# Altium schematic sheet Microcontroller.SchDoc
size A; SheetNumber: 2; SheetTotal: 2
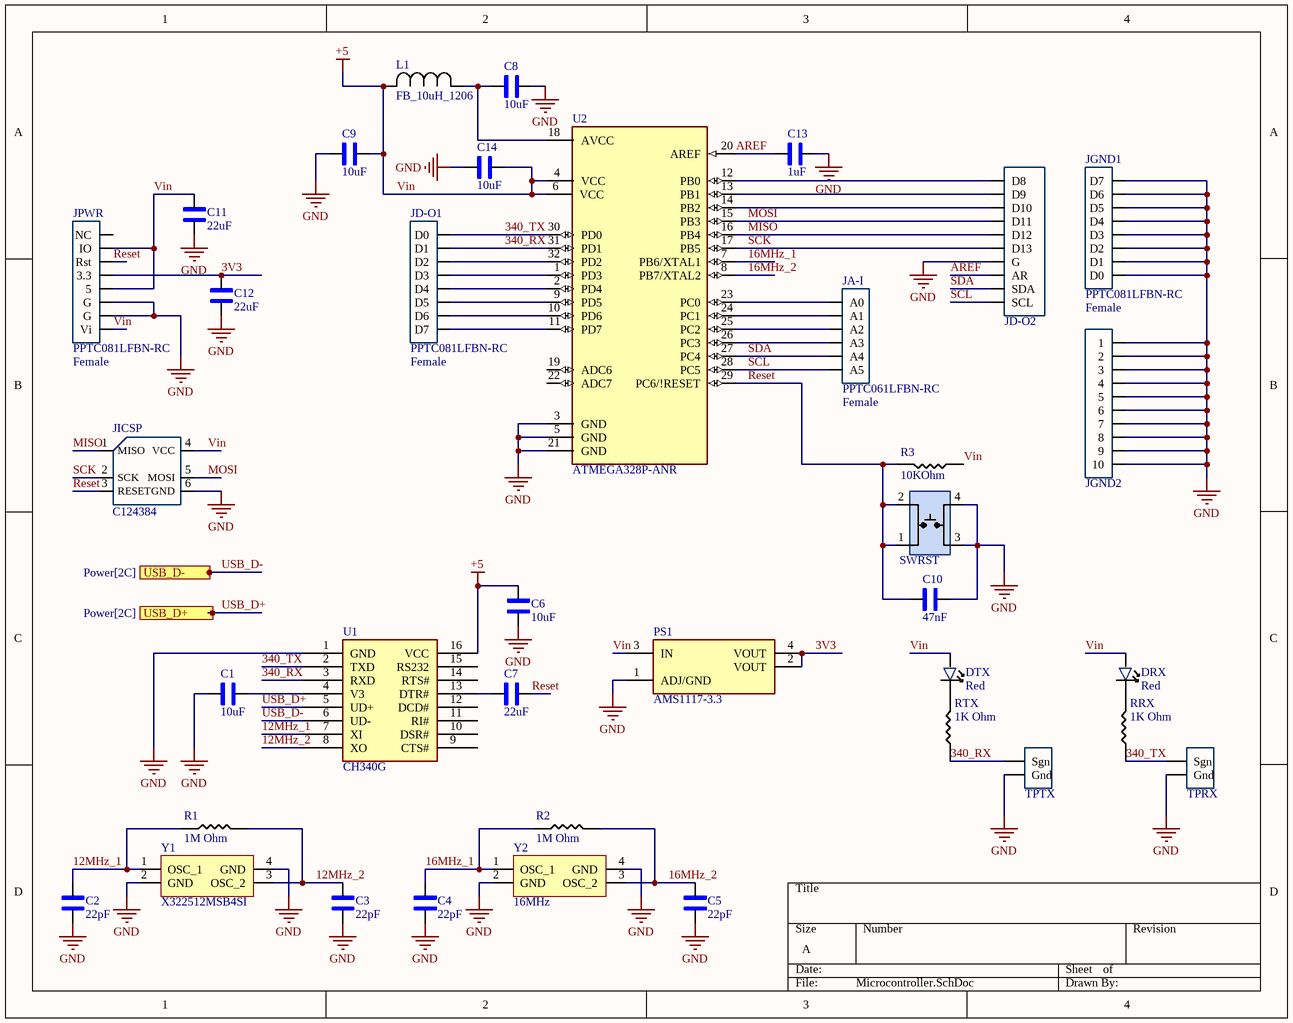
[diagram p0: Microcontroller.SchDoc]

## Parts
C1  10uF  [1206_Passive_Capacitor]
C2  22pF  [1206_Passive_Capacitor]
C3  22pF  [1206_Passive_Capacitor]
C4  22pF  [1206_Passive_Capacitor]
C5  22pF  [1206_Passive_Capacitor]
C6  10uF  [1206_Passive_Capacitor]
C7  22uF  [1206_Passive_Capacitor]
C8  10uF  [1206_Passive_Capacitor]
C9  10uF  [1206_Passive_Capacitor]
C10  47nF  [1206_Passive_Capacitor]
C11  22uF  [1206_Passive_Capacitor]
C12  22uF  [1206_Passive_Capacitor]
C13  1uF  [1206_Passive_Capacitor]
C14  10uF  [1206_Passive_Capacitor]
DRX  Red  [LED_1206]
DTX  Red  [LED_1206]
JA-I  PPTC061LFBN-RC  value Female  [6_PIN_ARD-Analog_100mil]
JD-O1  PPTC081LFBN-RC  value Female  [8_PIN_ARD-DIG_100MIL]
JD-O2  PPTC101LFBN-RC  [10_PIN_ARDUINO_100MIL]  (value not drawn)
JGND1  PPTC081LFBN-RC  value Female  [8_PIN_ARD-DIG_100MIL]
JGND2  PPTC101LFBN-RC  [10_PIN_100MIL - Female]  (value not drawn)
JICSP  LCSC Part#: C124384  [ICSP]  (hidden comment: NRPN032PAEN-RC)
JPWR  PPTC081LFBN-RC  value Female  [8_PIN_ARD-PWR_100MIL]
L1  FB_10uH_1206  [AIML-1206_ABR-M]
PS1  AMS1117-3.3  [LDO]
R1  value 1M Ohm  [1206_Passive_Resitor]  (hidden comment: 1M)
R2  value 1M Ohm  [1206_Passive_Resitor]  (hidden comment: 1M)
R3  value 10KOhm  [1206_Passive_Resitor]  (hidden comment: 10k)
RRX  value 1K Ohm  [1206_Passive_Resitor]  (hidden comment: 1k)
RTX  value 1K Ohm  [1206_Passive_Resitor]  (hidden comment: 1k)
SWRST  TL3305AF160QG  [Switch_JLC]  (value not drawn)
TPRX  10x Probe TP  [TP10x_Probe]  (value not drawn)
TPTX  10x Probe TP  [TP10x_Probe]  (value not drawn)
U1  CH340G  [USB to serial]
U2  ATMEGA328P-ANR  [ATMega328P]
Y1  X322512MSB4SI  [Crystal resonator]
Y2  value 16MHz  [Crystal resonator]  (hidden comment: X322516MLB4SI)

## Ports
USB_D+ (in, see Power[2C]), USB_D- (in, see Power[2C])

## Nets
GND: C1.1 C2.1 C3.1 C4.1 C5.1 C6.1 C8.1 C9.2 C10.1 C11.1 C12.1 C13.2 C14.2 JD-O2.4(G) JGND1.1(D7) JGND1.2(D6) JGND1.3(D5) JGND1.4(D4) JGND1.5(D3) JGND1.6(D2) JGND1.7(D1) JGND1.8(D0) JGND2.1 JGND2.2 JGND2.3 JGND2.4 JGND2.5 JGND2.6 JGND2.7 JGND2.8 JGND2.9 JGND2.10 JICSP.6(GND) JPWR.6(G) JPWR.7(G) PS1.1(ADJ/GND) SWRST.3 SWRST.4 TPRX.2(Gnd) TPTX.2(Gnd) U1.1(GND) U2.3(GND) U2.5(GND) U2.21(GND) Y1.2(GND) Y1.4(GND) Y2.2(GND) Y2.4(GND)
Vin: C6.2 C9.1 C11.2 C14.1 DRX.1 DTX.1 JICSP.4(VCC) JPWR.2(IO) JPWR.5 JPWR.8(Vi) L1.2 PS1.3(IN) R3.1 U1.16(VCC) U2.4(VCC) U2.6(VCC)  [also labelled +5]
3V3: C12.2 JPWR.4(3.3) PS1.2(VOUT) PS1.4(VOUT)
12MHz_1: C2.2 R1.1 U1.7(XI) Y1.1(OSC_1)
12MHz_2: C3.2 R1.2 U1.8(XO) Y1.3(OSC_2)
16MHz_1: C4.2 R2.1 U2.7(PB6/XTAL1) Y2.1(OSC_1)
16MHz_2: C5.2 R2.2 U2.8(PB7/XTAL2) Y2.3(OSC_2)
340_RX: JD-O1.7(D1) RTX.1 TPTX.1(Sgn) U1.3(RXD) U2.31(PD1)
340_TX: JD-O1.8(D0) RRX.1 TPRX.1(Sgn) U1.2(TXD) U2.30(PD0)
AREF: C13.1 JD-O2.3(AR) U2.20(AREF)
MISO: JD-O2.6(D12) JICSP.1(MISO) U2.16(PB4)
MOSI: JD-O2.7(D11) JICSP.5(MOSI) U2.15(PB3)
Reset: C7.2 C10.2 JICSP.3(RESET) JPWR.3(Rst) R3.2 SWRST.1 SWRST.2 U2.29(PC6/!RESET)
SCK: JD-O2.5(D13) JICSP.2(SCK) U2.17(PB5)
SCL: JA-I.6(A5) JD-O2.1(SCL) U2.28(PC5)
SDA: JA-I.5(A4) JD-O2.2(SDA) U2.27(PC4)
USB_D+: U1.5(UD+) ; port USB_D+
USB_D-: U1.6(UD-) ; port USB_D-
NetC1_2: C1.2 U1.4(V3)
NetC7_1: C7.1 U1.13(DTR#)
NetC8_2: C8.2 L1.1 U2.18(AVCC)
NetDRX_2: DRX.2 RRX.2
NetDTX_2: DTX.2 RTX.2
NetJA-I_1: JA-I.1(A0) U2.23(PC0)
NetJA-I_2: JA-I.2(A1) U2.24(PC1)
NetJA-I_3: JA-I.3(A2) U2.25(PC2)
NetJA-I_4: JA-I.4(A3) U2.26(PC3)
NetJD-O1_1: JD-O1.1(D7) U2.11(PD7)
NetJD-O1_2: JD-O1.2(D6) U2.10(PD6)
NetJD-O1_3: JD-O1.3(D5) U2.9(PD5)
NetJD-O1_4: JD-O1.4(D4) U2.2(PD4)
NetJD-O1_5: JD-O1.5(D3) U2.1(PD3)
NetJD-O1_6: JD-O1.6(D2) U2.32(PD2)
NetJD-O2_8: JD-O2.8(D10) U2.14(PB2)
NetJD-O2_9: JD-O2.9(D9) U2.13(PB1)
NetJD-O2_10: JD-O2.10(D8) U2.12(PB0)

Not connected (* = marked no-connect by the designer): JPWR 1(NC); U1 9(CTS#) 10(DSR#) 11(RI#) 12(DCD#) 14(RTS#) 15(RS232); U2 19(ADC6) 22(ADC7)

## Library data of the parts
C1 C6 C8 C9 C14 = C_10uF_1206: 10uF ±10% 50V X5R 1206 Multilayer Ceramic Capacitors MLCC - SMD/SMT RoHS; MFR Part #: CL31A106KBHNNNE; Type: Basic; LCSC Part#: C13585; Datasheet: https://datasheet.lcsc.com/lcsc/1810221112_Samsung-Electro-Mechanics-CL31A106KBHNNNE_C13585.pdf; Value: 10uF
C2-C5 = C_22pF_1206: 22pF ±5% 1kV C0G 1206 Multilayer Ceramic Capacitors MLCC - SMD/SMT RoHS; MFR Part #: CC1206JKNPOCBN220; Type: Extended; LCSC Part#: C107174; Datasheet: https://datasheet.lcsc.com/lcsc/1810241219_YAGEO-CC1206JKNPOCBN220_C107174.pdf; Value: 22pF
C7 C11 C12 = C_22uF_1206: 22uF ±10% 25V X5R 1206 Multilayer Ceramic Capacitors MLCC - SMD/SMT RoHS; MFR Part #: CL31A226KAHNNNE; Type: basic; LCSC Part#: C12891; Datasheet: https://datasheet.lcsc.com/lcsc/1811031514_Samsung-Electro-Mechanics-CL31A226KAHNNNE_C12891.pdf; Value: 22uF
C10 = C_47nF_1206: 47nF ±5% 50V C0G 1206 Multilayer Ceramic Capacitors MLCC - SMD/SMT RoHS; MFR Part #: GRM31M5C1H473JA01L; Type: Extended; LCSC Part#: C21812; Datasheet: https://datasheet.lcsc.com/lcsc/1810201313_Murata-Electronics-GRM31M5C1H473JA01L_C21812.pdf; Value: 47nF
C13 = C_1uF_1206: MULTILAYER CERAMIC CAPACITORS MLCC - SMD/SMT 1UF 50V 1206 ROHS; MFR Part #: CL31B105KBHNNNE; Type: Basic; Digikey Link: https://www.digikey.com/product-detail/en/C1206C105M4RACTU/399-8150-1-ND/3471873/?itemSeq=304982366; LCSC Part#: C1848; Value: 1uF
DRX DTX = LED_RED_1206: Red 621~631nm 1206 Light Emitting Diodes (LED) RoHS; MFR Part #: 15-21/R6C-FQ1R1B/2T; LCSC Part#: C93133; Type: Extended; Datasheet: https://datasheet.lcsc.com/szlcsc/1811151241_Everlight-Elec-15-21-R6C-FQ1R1B-2T_C93133.pdf; Value: Red
JA-I = JF_6_PIN_FEMA_ARD-Anolog: 6 Position Header Connector 0.100" (2.54mm) Through Hole Tin; Digikey Link: https://www.digikey.com/product-detail/en/PPTC061LFBN-RC/S7004-ND/810145/?itemSeq=304982353; MFR Part #: PPTC061LFBN-RC; LCSC Part#: C40877; Type: Extended
JD-O1 JGND1 = JF_8_PIN_FEMA_ARD-Dig: 8 Position Header Connector 0.100" (2.54mm) Through Hole Tin; Digikey Link: https://www.digikey.com/product-detail/en/PPTC081LFBN-RC/S7006-ND/810147/?itemSeq=304982354; MFR Part #: PPTC081LFBN-RC; Type: Extended; LCSC Part#: C27438
JD-O2 = JF_10_PIN_FEMA_ARDUINO: 10 Position Header Connector 0.100" (2.54mm) Through Hole Tin; Value: Female; Digikey Link: https://www.digikey.com/product-detail/en/PPTC101LFBN-RC/S7008-ND/810149/?itemSeq=304982352; MFR Part #: PPTC101LFBN-RC; LCSC Part#: C225507; Type: Extended
JGND2 = JF_10_PIN_FEMALE_: 10 Position Header Connector 0.100" (2.54mm) Through Hole Tin; Value: Female; Digikey Link: https://www.digikey.com/product-detail/en/PPTC101LFBN-RC/S7008-ND/810149/?itemSeq=304982352; MFR Part #: PPTC101LFBN-RC; LCSC Part#: C225507; Type: Extended
JICSP = J_ICSP: Connector Header Through Hole 6 position 0.079" (2.00mm); Digikey Link: https://www.digikey.com/product-detail/en/NRPN032PAEN-RC/S5801-03-ND/804955/?itemSeq=304982355; MFR Part #: NRPN032PAEN-RC; Type: Extended
JPWR = JF_8_PIN_FEMA_ARD-Pwr: 8 Position Header Connector 0.100" (2.54mm) Through Hole Tin; Digikey Link: https://www.digikey.com/product-detail/en/PPTC081LFBN-RC/S7006-ND/810147/?itemSeq=304982354; MFR Part #: PPTC081LFBN-RC; Type: Extended; LCSC Part#: C27438
L1 = FB_10uH_1206: 25mA 10uH ±10% 800mΩ 1206  Inductors (SMD) ROHS; Mfr_Name: FH (Guangdong Fenghua Advanced Tech); MFR PART #: CMI321609X100KT; Type: Basic; LCSC PART#: C1051; DataSheet: https://datasheet.lcsc.com/lcsc/1810311314_FH--Guangdong-Fenghua-Advanced-Tech-CMI321609X100KT_C1051.pdf
PS1 = PS_AMS_LDO_3v3: LOW DROPOUT REGULATORS(LDO) POSITIVE FIXED 1.3V @ 800MA 15V 3.3V 1A SOT-223 ROHS; Value: IC REG LINEAR 3.3V 800MA SOT223; MFR Part #: AMS1117-3.3; LCSC Part#: C6186; Type: Basic
R1 R2 = R_1M_1206: CHIP RESISTOR - SURFACE MOUNT 1MOHMS ±1% 1/4W 1206 ROHS; MFR Part #: RMCF1206JT1M00; Digikey Link: https://www.digikey.com/product-detail/en/RMCF1206JT1M00/RMCF1206JT1M00CT-ND/1942830/?itemSeq=304982358; LCSC Part#: C17927; Type: Basic
R3 = R_10KOhm_1206: 10 kOhms ±5% 0.25W, 1/4W Chip Resistor 1206 (3216 Metric) Automotive AEC-Q200 Thick Film; MFR Part #: RMCF1206FT10K0; Digikey Link: https://www.digikey.com/en/products/detail/stackpole-electronics-inc/RMCF1206FT10K0/1759669; LCSC Part#: C17902; Type: Basic
RRX RTX = R_1K_1206: CHIP RESISTOR - SURFACE MOUNT 1KOHMS ±1% 1/4W 1206 ROHS; MFR Part #: RNCP1206FTD1K00CT; Digikey Link: https://www.digikey.com/product-detail/en/RNCP1206FTD1K00/RNCP1206FTD1K00CT-ND/2240675/?itemSeq=304982373; LCSC Part#: C4410; Type: Basic
SWRST = SW_Push_Button_JLC: Tactile Switch SPST-NO Top Actuated Surface Mount; MFR Part #: KH-4.5X4.5X4.3H-STM; LCSC Part#: C2837550; Type: Extended; DataSheet: https://datasheet.lcsc.com/lcsc/2106081532_Shenzhen-Kinghelm-Elec-KH-4.5X4.5X4.3H-STM_C2837550.pdf
TPRX TPTX = TP_10x_Probe: Test Point 300 mil centers
U1 = U_USBtoSerial: Transceiver USB 2.0 2Mbps SOP-16_150mil USB ICs RoHS; Datasheet: https://datasheet.lcsc.com/lcsc/2008191806_WCH-Jiangsu-Qin-Heng-CH340G_C14267.pdf; LCSC Part#: C14267; MFR Part #: CH340G; Type: Basic; Value: USB to Serial
U2 = U_ATMega328P: AVR AVR® ATmega Microcontroller IC 8-Bit 20MHz 32KB (16K x 16) FLASH 32-TQFP (7x7); MFR Part #: ATMEGA328P-AU; Value: IC MCU 8BIT 32KB FLASH 32TQFP; Digikey Link: https://www.digikey.com/product-detail/en/ATMEGA328P-ANR/ATMEGA328P-ANRCT-ND/2774230/?itemSeq=304982365; LCSC Part#: C14877; Type: Basic
Y1 = X_12MHz_Res: SMD Crystal Resonators 12MHz ±10ppm SMD-3225_4P RoHS; LCSC Part#: C9002; MFR Part #: X322512MSB4SI; Value: 12MHz; Type: Basic; Datasheet: https://datasheet.lcsc.com/szlcsc/Yangxing-Tech-X322512MSB4SI_C9002.pdf
Y2 = X_16Mhz_Res: ±10ppm 16000000Hz -40℃~85℃ 贴片无源晶振 60Ω 9pF SMD3225-4P Crystals ROHS; LCSC Part#: C13738; MFR Part #: X322516MLB4SI; Type: Basic